# Altium project Glucometer-E.C.- Full V1.PrjPcb
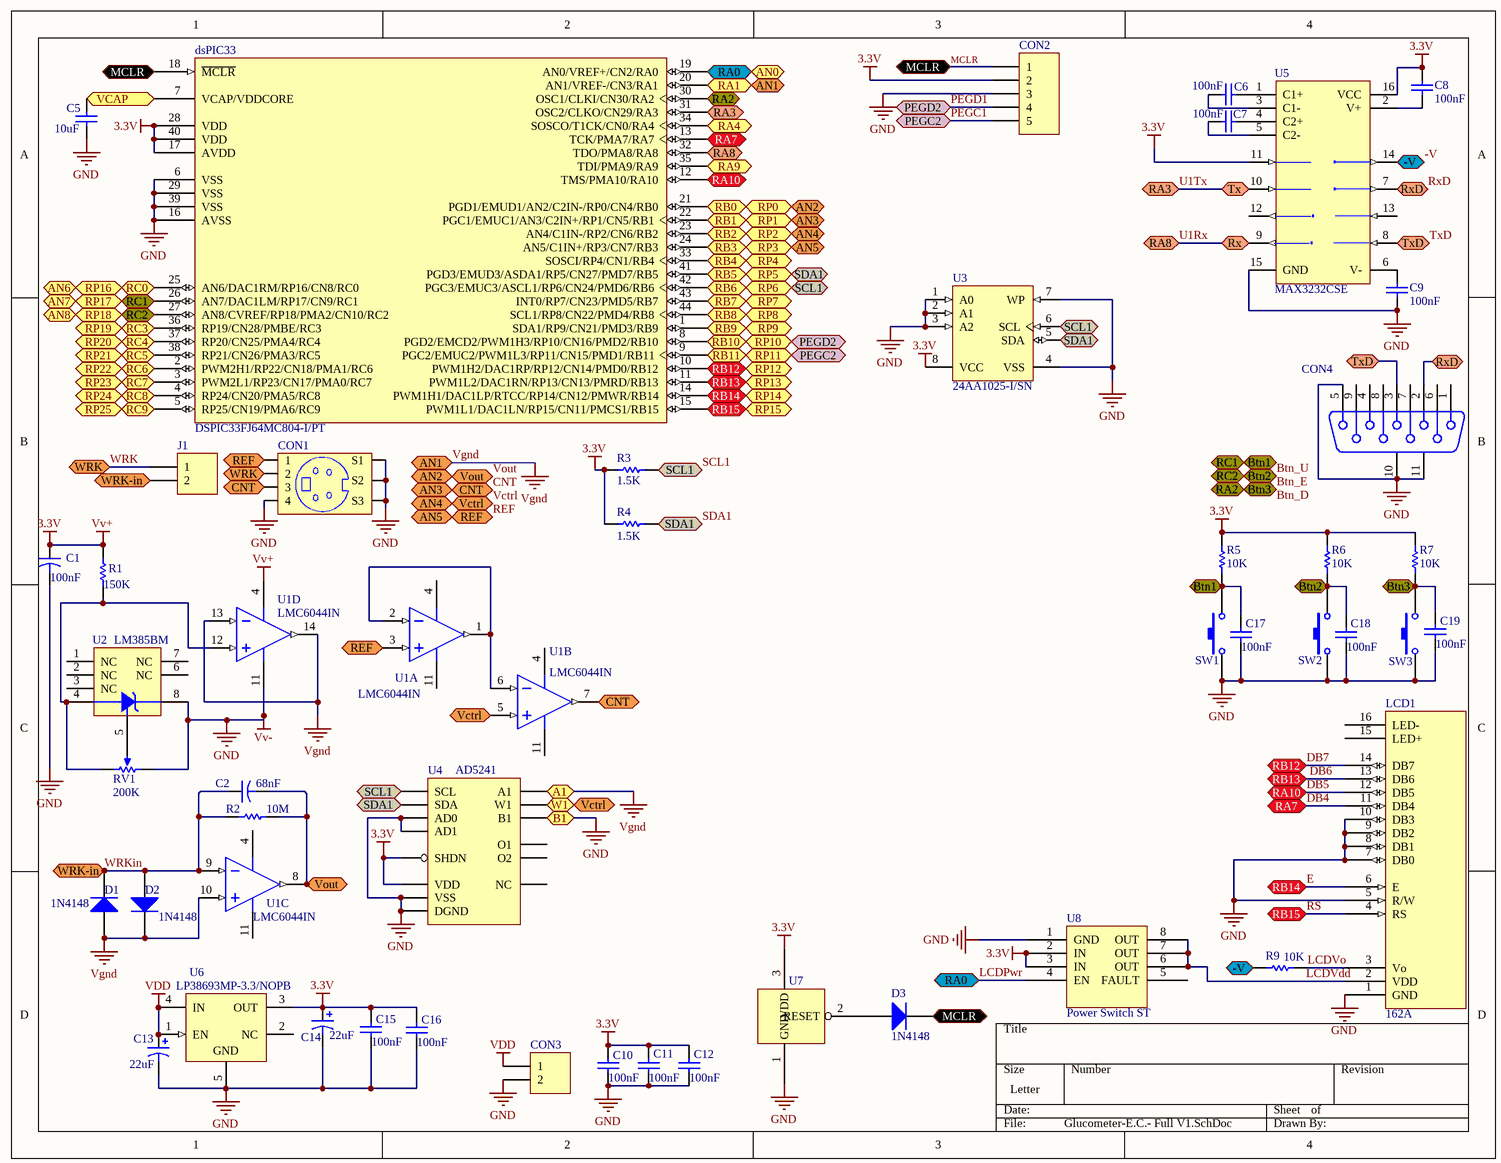
[diagram p0: Glucometer-E.C.- Full V1.SchDoc]
1 sheet, 47 parts. Net scope: flat (ports and power ports of the same name join across sheets).
Board file: Glucometer-E.C.- Full V1.PcbDoc

## Sheet Glucometer-E.C.- Full V1.SchDoc
size Letter

### Parts
C1  value 100nF  [CAPC1608N]  (hidden comment: Cap2)
C2  value 68nF  [CAPC1608N]  (hidden comment: Cap2)
C5  value 10uF  [CAPC2012N]  (hidden comment: Cap)
C6  value 100nF  [RESC1608N]  (hidden comment: Cap)
C7  value 100nF  [RESC1608N]  (hidden comment: Cap)
C8  value 100nF  [RESC1608N]  (hidden comment: Cap)
C9  value 100nF  [RESC1608N]  (hidden comment: Cap)
C10  value 100nF  [CAPC1608N]  (hidden comment: Cap)
C11  value 100nF  [CAPC1608N]  (hidden comment: Cap)
C12  value 100nF  [CAPC1608N]  (hidden comment: Cap)
C13  value 22uF  [C-4x4]  (hidden comment: Cap Pol2)
C14  value 22uF  [C-4x4]  (hidden comment: Cap Pol2)
C15  value 100nF  [CAPC1608N]  (hidden comment: Cap)
C16  value 100nF  [CAPC1608N]  (hidden comment: Cap)
C17  value 100nF  [CAPC1608N]  (hidden comment: Cap)
C18  value 100nF  [CAPC1608N]  (hidden comment: Cap)
C19  value 100nF  [CAPC1608N]  (hidden comment: Cap)
CON1  (no value)  [CDIN2.6-3H4A]
CON2  Header 5  [HDR1X5]  (value not drawn)
CON3  Header 2  [HDR1X2]  (value not drawn)
CON4  D Connector 9  [DSUB1.385-2H9]  (value not drawn)
D1  1N4148  [DO-35]
D2  1N4148  [DO-35]
D3  1N4148  [DO-35]
dsPIC33  DSPIC33FJ64MC804-I/PT  [TQFP-PT44_N]
J1  Header 2  [HDR1X2]  (value not drawn)
LCD1  162A  [HDR1X16]
R1  value 150K  [RESC3216N]  (hidden comment: Res1)
R2  value 10M  [RESC3216N]  (hidden comment: Res1)
R3  value 1.5K  [RESC3216N]  (hidden comment: Res1)
R4  value 1.5K  [RESC3216N]  (hidden comment: Res1)
R5  value 10K  [RESC3216N]  (hidden comment: Res1)
R6  value 10K  [RESC3216N]  (hidden comment: Res1)
R7  value 10K  [RESC3216N]  (hidden comment: Res1)
R9  value 10K  [RESC3216N]  (hidden comment: Res1)
RV1  value 200K  [VR5]  (hidden comment: RPot)
SW1  SW-PB  [DPST-4]  (value not drawn)
SW2  SW-PB  [DPST-4]  (value not drawn)
SW3  SW-PB  [DPST-4]  (value not drawn)
U1  LMC6044IN  [M14A_N]  (parts A,B,C,D of 4)
U2  LM385BM  [M08A_N]
U3  24AA1025-I/SN  [SOIC-SN8_N]
U4  AD5241  [R-14_N]
U5  MAX3232CSE  [NSO16_N]
U6  LP38693MP-3.3/NOPB  [MP05A_N]
U7  Supply Voltage Supervisor  [SOT23]  (value not drawn)
U8  Power Switch ST  [SO8_N]

### Ports
-V, A1, AN0, AN1, AN2, AN3, AN4, AN5, AN6, AN7, AN8, B1, Btn1, Btn2, Btn3, CNT, MCLR, PEGC2, PEGD2, RA0, RA1, RA2, RA3, RA4, RA7, RA8, RA9, RA10, RB0, RB1, RB2, RB3, RB4, RB5, RB6, RB7, RB8, RB9, RB10, RB11, RB12, RB13, RB14, RB15, RC0, RC1, RC2, RC3, RC4, RC5, RC6, RC7, RC8, RC9, REF, RP0, RP1, RP2, RP3, RP4, RP5, RP6, RP7, RP8, RP9, RP10, RP11, RP12, RP13, RP14, RP15, RP16, RP17, RP18, RP19, RP20, RP21, RP22, RP23, RP24, RP25, Rx, RxD, SCL1, SDA1, Tx, TxD, VCAP, Vctrl, Vout, W1, WRK, WRK-in

### Nets
3.3V: C1.1 C8.1 C10.2 C11.2 C12.2 C14.1 C15.2 C16.2 CON2.2 dsPIC33.17(AVDD) dsPIC33.28(VDD) dsPIC33.40(VDD) R1.2 R3.1 R4.1 R5.2 R6.2 R7.2 U1.4(V+) U3.8(VCC) U4.4(VDD) U4.5(SHDN) U5.11(T1IN) U5.16(VCC) U6.3(OUT) U7.3(VDD) U8.2(IN) U8.3(IN)  [also labelled Vv+]
GND: C1.2 C5.1 C9.2 C10.1 C11.1 C12.1 C13.2 C14.2 C15.1 C16.1 C17.1 C18.1 C19.1 CON1.4 CON1.MH1(S1) CON1.MH2(S2) CON1.MH3(S3) CON2.3 CON3.2 CON4.5 CON4.10(MH1) CON4.11(MH2) dsPIC33.6(VSS) dsPIC33.16(AVSS) dsPIC33.29(VSS) dsPIC33.39(VSS) LCD1.1(GND) LCD1.5(R/W) LCD1.7(DB0) LCD1.8(DB1) LCD1.9(DB2) LCD1.10(DB3) RV1.1(TOP) SW1.1 SW2.1 SW3.1 U1.11(V-) U2.8(+V) U3.1(A0) U3.2(A1) U3.3(A2) U3.4(VSS) U3.7(WP) U4.3(B1) U4.8(AD0) U4.9(AD1) U4.10(DGND) U4.11(VSS) U5.15(GND) U6.5(GND) U7.1(GND) U8.1(GND) ; port B1  [also labelled Vv-]
VDD: C13.1 CON3.1 U6.1(EN) U6.4(IN)
Vgnd: D1.1(A) D2.2(K) dsPIC33.20(AN1/VREF-/CN3/RA1) U1.10(IN3+) U1.13(IN4-) U1.14(OUT4) U4.1(A1) ; port RA1, port AN1, port A1
 DB6: dsPIC33.11(PWM1L2/DAC1RN/RP13/CN13/PMRD/RB13) LCD1.13(DB6) ; port RP13, port RB13
-V: R9.2 U5.14(T1OUT) ; port -V
Btn_E: C19.2 dsPIC33.30(OSC1/CLKI/CN30/RA2) R7.1 SW3.2 ; port RA2, port Btn3
Btn_U: C18.2 dsPIC33.27(AN8/CVREF/RP18/PMA2/CN10/RC2) R6.1 SW2.2 ; port RP18, port AN8, port RC2, port Btn2
CNT: CON1.3 dsPIC33.22(PGC1/EMUC1/AN3/C2IN+/RP1/CN5/RB1) U1.7(OUT2) ; port RB1, port RP1, port CNT, port AN3
DB4: dsPIC33.13(TCK/PMA7/RA7) LCD1.11(DB4) ; port RA7
DB5: dsPIC33.12(TMS/PMA10/RA10) LCD1.12(DB5) ; port RA10
DB7: dsPIC33.10(PWM1H2/DAC1RP/RP12/CN14/PMD0/RB12) LCD1.14(DB7) ; port RB12, port RP12
E: dsPIC33.14(PWM1H1/DAC1LP/RTCC/RP14/CN12/PMWR/RB14) LCD1.6(E) ; port RP14, port RB14
LCDPwr: dsPIC33.19(AN0/VREF+/CN2/RA0) U8.4(EN) ; port RA0, port AN0
LCDVdd: LCD1.2(VDD) U8.6(OUT) U8.7(OUT) U8.8(OUT)
LCDVo: LCD1.3(Vo) R9.1
MCLR: CON2.1 D3.2(K) dsPIC33.18(~{MCLR}) ; port MCLR
PEGC1: CON2.5 dsPIC33.9(PGC2/EMUC2/PWM1L3/RP11/CN15/PMD1/RB11) ; port RB11, port RP11, port PEGC2
PEGD1: CON2.4 dsPIC33.8(PGD2/EMCD2/PWM1H3/RP10/CN16/PMD2/RB10) ; port RB10, port RP10, port PEGD2
REF: CON1.1 dsPIC33.24(AN5/C1IN+/RP3/CN7/RB3) U1.3(IN1+) ; port RP3, port REF, port AN5, port RB3
RS: dsPIC33.15(PWM1L1/DAC1LN/RP15/CN11/PMCS1/RB15) LCD1.4(RS) ; port RP15, port RB15
RxD: CON4.2 U5.7(T2OUT) ; port RxD
SCL1: dsPIC33.42(PGC3/EMUC3/ASCL1/RP6/CN24/PMD6/RB6) R3.2 U3.6(SCL) U4.6(SCL) ; port RB6, port RP6, port SCL1
SDA1: dsPIC33.41(PGD3/EMUD3/ASDA1/RP5/CN27/PMD7/RB5) R4.2 U3.5(SDA) U4.7(SDA) ; port RB5, port RP5, port SDA1
TxD: CON4.3 U5.8(R2IN) ; port TxD
U1Rx: dsPIC33.32(TDO/PMA8/RA8) U5.9(R2OUT) ; port Rx, port RA8
U1Tx: dsPIC33.31(OSC2/CLKO/CN29/RA3) U5.10(T2IN) ; port Tx, port RA3
Vctrl: dsPIC33.23(AN4/C1IN-/RP2/CN6/RB2) U1.5(IN2+) U4.2(W1) ; port RB2, port RP2, port Vctrl, port AN4, port W1
Vout: C2.2 dsPIC33.21(PGD1/EMUD1/AN2/C2IN-/RP0/CN4/RB0) R2.1 U1.8(OUT3) ; port RB0, port RP0, port Vout, port AN2
WRK: CON1.2 J1.1 ; port WRK
WRKin: C2.1 D1.2(K) D2.1(A) J1.2 R2.2 U1.9(IN3-) ; port WRK-in
NetC5_2: C5.2 dsPIC33.7(VCAP/VDDCORE) ; port VCAP
NetC6_1: C6.1 U5.1(C1+)
NetC6_2: C6.2 U5.3(C1-)
NetC7_1: C7.1 U5.4(C2+)
NetC7_2: C7.2 U5.5(C2-)
NetC8_2: C8.2 U5.2(V+)
NetC9_1: C9.1 U5.6(V-)
NetC17_2: C17.2 dsPIC33.26(AN7/DAC1LM/RP17/CN9/RC1) R5.1 SW1.2 ; port RP17, port AN7, port RC1, port Btn1
NetD3_1: D3.1(A) U7.2(RESET)
NetdsPIC33_1: dsPIC33.1(SDA1/RP9/CN21/PMD3/RB9) ; port RB9, port RP9
NetdsPIC33_2: dsPIC33.2(PWM2H1/RP22/CN18/PMA1/RC6) ; port RC6, port RP22
NetdsPIC33_3: dsPIC33.3(PWM2L1/RP23/CN17/PMA0/RC7) ; port RC7, port RP23
NetdsPIC33_4: dsPIC33.4(RP24/CN20/PMA5/RC8) ; port RC8, port RP24
NetdsPIC33_5: dsPIC33.5(RP25/CN19/PMA6/RC9) ; port RC9, port RP25
NetdsPIC33_25: dsPIC33.25(AN6/DAC1RM/RP16/CN8/RC0) ; port RP16, port AN6, port RC0
NetdsPIC33_33: dsPIC33.33(SOSCI/RP4/CN1/RB4) ; port RP4, port RB4
NetdsPIC33_34: dsPIC33.34(SOSCO/T1CK/CN0/RA4) ; port RA4
NetdsPIC33_35: dsPIC33.35(TDI/PMA9/RA9) ; port RA9
NetdsPIC33_36: dsPIC33.36(RP19/CN28/PMBE/RC3) ; port RP19, port RC3
NetdsPIC33_37: dsPIC33.37(RP20/CN25/PMA4/RC4) ; port RP20, port RC4
NetdsPIC33_38: dsPIC33.38(RP21/CN26/PMA3/RC5) ; port RP21, port RC5
NetdsPIC33_43: dsPIC33.43(INT0/RP7/CN23/PMD5/RB7) ; port RB7, port RP7
NetdsPIC33_44: dsPIC33.44(SCL1/RP8/CN22/PMD4/RB8) ; port RB8, port RP8
NetR1_1: R1.1 RV1.2(BOT) U1.12(IN4+) U2.4(-V)
NetRV1_3: RV1.3(TAP) U2.5(FB)
NetU1_1: U1.1(OUT1) U1.2(IN1-) U1.6(IN2-)

Not connected (* = marked no-connect by the designer): CON4 1 4 6 7 8 9; LCD1 15(LED+) 16(LED-); U2 1(NC) 2(NC) 3(NC) 6(NC) 7(NC); U4 12(O2) 13(NC) 14(O1); U5 12(R1OUT) 13(R1IN); U6 2(NC); U8 5(FAULT)

### Notes on the sheet
- Labels drawn without touching a wire or pin: Btn_D

### Library data of the parts
C1 C2 = Cap2: Capacitor; Published: 23-Sep-2002; PackageReference: CAPR5-4X5; Publisher: Altium Limited; PackageDescription: Capacitor; 2 Leads
C5-C12 C15-C19 = Cap: Capacitor; Published: 8-Jun-2000; LatestRevisionDate: 17-Jul-2002; LatestRevisionNote: Re-released for DXP Platform.; PackageReference: RAD-0.3; Publisher: Altium Limited; PackageDescription: Radial Cap, Thru-Hole; 2 Leads; 0.3 in Pin Spacing
C13 C14 = Cap Pol2: Polarized Capacitor (Axial); Published: 8-Jun-2000; LatestRevisionDate: 17-Jul-2002; LatestRevisionNote: Re-released for DXP Platform.; PackageReference: POLAR0.8; Publisher: Altium Limited; PackageDescription: Polarized Capacitor; 2 Leads
CON1 = MiniDin 4Pins - SuperVideo: MiniDin 4 Pins
CON2 = Header 5: Header, 5-Pin; LatestRevisionDate: 17-Jul-2002; LatestRevisionNote: Re-released for DXP Platform.; Publisher: Altium Limited
CON3 J1 = Header 2: Header, 2-Pin; LatestRevisionDate: 17-Jul-2002; LatestRevisionNote: Re-released for DXP Platform.; Publisher: Altium Limited
CON4 = D Connector 9: Receptacle Assembly, 9 Position, Right Angle; PackageDocument: O; Positions: 9; Published: 15-Jun-2001; LatestRevisionDate: 17-Jul-2002; LatestRevisionNote: Re-released for DXP Platform.; DatasheetDocument: 1-Sep-1999; PackageReference: 788750; Publisher: Altium Limited; Orientation: Right Angle; Gender: Receptacle
D1-D3 = 1N4148: High Conductance Fast Diode; Published: 8-Jun-2000; LatestRevisionDate: 17-Jul-2002; LatestRevisionNote: Re-released for DXP Platform.; DatasheetDocument: 1997; PackageReference: DO-35; Publisher: Altium Limited; Code_JEDEC: DO-204-AH; ComponentLink1Description: Manufacturer Link; ComponentLink1URL: http://www.fairchildsemi.com/; ComponentLink2Description: Datasheet; ComponentLink2URL: http://www.fairchildsemi.com/ds/1N%2F1N4148.pdf
dsPIC33 = DSPIC33FJ64MC804-I/PT: High-Performance 16-bit Digital Signal Controller, 64 KB Flash, 16 KB RAM, 44-Pin TQFP, Industrial Temperature; Published: 2-Dec-2009; DatasheetVersion: revD, Nov-2009; PackageVersion: revBB, Aug-2009; PackageReference: TQFP-PT44; Publisher: Altium Limited; PackageDescription: 44-Lead Plastic Thin Quad Flatpack (PT) - 10x10x1mm Body, 2.00mm [TQFP]; Supplier 1: Digi-Key; Supplier Part Number 1: DSPIC33FJ64MC804-I/PT-ND; Supplier 2: Farnell; Supplier Part Number 2: 1576844; Code_JEDEC: MS-026; ComponentLink1Description: Datasheet; ComponentLink1URL: http://ww1.microchip.com/downloads/en/DeviceDoc/70291D.pdf; ComponentLink2Description: Packaging Specification; ComponentLink2URL: http://www.microchip.com/stellent/groups/techpub_sg/documents/packagingspec/en012702.pdf; ComponentLink3Description: Microchip.com Home; ComponentLink3URL: http://www.microchip.com/
LCD1 = 162A: 16 char * 2 line LCD character display with b/light
R1-R7 R9 = Res1: Resistor; Published: 8-Jun-2000; LatestRevisionDate: 17-Jul-2002; LatestRevisionNote: Re-released for DXP Platform.; PackageReference: AXIAL-0.3; Publisher: Altium Limited; PackageDescription: Axial Device, Thru-Hole; 2 Leads; 0.3 in Pin Spacing
RV1 = RPot: Potentiometer; pin to pad: 2>3 3>2; Sim Note: Enter the Resistance value and the set point into parameter fields.; Set Position: 0.5; Published: 8-Jun-2000; LatestRevisionDate: 17-Jul-2002; LatestRevisionNote: Re-released for DXP Platform.; PackageReference: VR5; Publisher: Altium Limited; PackageDescription: Variable Resistor, Thru-Hole; 3 Leads
SW1-SW3 = SW-PB: Switch; Published: 24-Mar-1999; LatestRevisionDate: 17-Jul-2002; LatestRevisionNote: Re-released for DXP Platform.; PackageReference: SPST-2; Publisher: Altium Limited; PackageDescription: Switch; 2 Leads
U1 = LMC6044IN: CMOS Quad Micropower Operational Amplifier, 14-pin MDIP; Manufacturer: National Semiconductor; PackageTopMarking: NSUZXYYTTE#*LMC6044IN; PowerWise: Y; CompType: Amplifiers; Published: 4-Dec-2008; LatestRevisionDate: 13-Jan-2009; LatestRevisionNote: Sim Model Added.; DatasheetVersion: Aug-2000; PackageVersion: revG, May-2006; PackageReference: N14A; Publisher: Altium Limited; PackageDescription: MDIP, .750 x .250 x.130in, 14 Lead, .100in Pitch; Supplier 1: Farnell; Supplier Part Number 1: 9494634; PartNumber: LMC6044IN; RoHS: N; PinCount: 14; Code_JEDEC: MS-001-AA; ComponentLink1Description: LMC6044 Datasheet; ComponentLink1URL: http://www.national.com/ds/LM/LMC6044.pdf; ComponentLink2Description: LMC6044 Web Page; ComponentLink2URL: http://www.national.com/pf/LM/LMC6044.html; ComponentLink3Description: N14A Package Page; ComponentLink3URL: http://www.national.com/packaging/folders/n14a.html
U2 = LM385BM: Adjustable Micropower Voltage Reference, 8-pin Narrow SOIC; Manufacturer: National Semiconductor; PackageTopMarking: NSZXTT*LM385*BM; PowerWise: N; CompType: Voltage Reference IC; Published: 4-Dec-2008; DatasheetVersion: Jan-2008; PackageVersion: revM, May-2009; PackageReference: M08A; Publisher: Altium Limited; PackageDescription: SOIC Narrow, 4.9 x 3.9 x 1.45mm, 8 Lead, 1.27mm Pitch; Supplier 1: Farnell; Supplier Part Number 1: 953817; PartNumber: LM385BM; RoHS: N; PinCount: 8; Code_JEDEC: MS-012-AA; Code_IPC: SOIC127P600-8; ComponentLink1Description: LM385-ADJ Datasheet; ComponentLink1URL: http://www.national.com/ds/LM/LM385-ADJ.pdf; ComponentLink2Description: LM385-ADJ Web Page; ComponentLink2URL: http://www.national.com/pf/LM/LM385-ADJ.html; ComponentLink3Description: M08A Package Page; ComponentLink3URL: http://www.national.com/packaging/folders/m08a.html
U3 = 24AA1025-I/SN: 1 Mbit, 400kHz, 1.7V, 8-Pin SOIC 150mil, Industrial Temperature; Published: 2-Dec-2009; DatasheetVersion: revF, Oct-2008; PackageVersion: revBB, Aug-2009; PackageReference: SOIC-SN8; Publisher: Altium Limited; PackageDescription: 8-Lead Plastic Small Outline (SN) - Narrow, 3.90mm Body [SOIC]; Supplier 1: Digi-Key; Supplier Part Number 1: 24AA1025-I/SN-ND; Code_JEDEC: MS-012; Code_IPC: SOIC127P600-8; ComponentLink1Description: Datasheet; ComponentLink1URL: http://ww1.microchip.com/downloads/en/DeviceDoc/21941F.pdf; ComponentLink2Description: Packaging Specification; ComponentLink2URL: http://www.microchip.com/stellent/groups/techpub_sg/documents/packagingspec/en012702.pdf; ComponentLink3Description: Microchip.com Home; ComponentLink3URL: http://www.microchip.com/
U4 = AD5241: AD5241BR
U5 = MAX3232CSE: 3.0V TO 5.5V, Low-Power, up to 1Mbps, True RS-232 Transceiver Using Four 0.1µF External Capacitor; Published: 16-Jan-2001; LatestRevisionDate: 13-Apr-2006; LatestRevisionNote: IPC-7351 Footprint Added.; DatasheetVersion: Mar-1999; PackageReference: NSO16; Publisher: Altium Limited; PackageDescription: 16-Pin Small Outline Integrated Circuit 1.27 mm Pitch; Code_JEDEC: MS-012-AC; Code_IPC: SOIC127P600-16; ComponentLink1Description: Manufacturer Link; ComponentLink1URL: http://www.maxim-ic.com/; ComponentLink2Description: Datasheet; ComponentLink2URL: http://pdfserv.maxim-ic.com/en/ds/MAX3222-MAX3241.pdf
U6 = LP38693MP-3.3/NOPB: 500mA Low Dropout CMOS Linear Regulators Stable with Ceramic Output Capacitors, 5-pin SOT-223, Pb-Free; Manufacturer: National Semiconductor; PackageTopMarking: XYTT*LJYB; PowerWise: Y; CompType: LDO IC; Published: 1-Mar-2010; DatasheetVersion: Sep-2005; PackageVersion: revA, Jan-2000; PackageReference: MP05A; Publisher: Altium Limited; PackageDescription: Moldec SOT-223, 6.50 x 3.56 x 1.6mm Body, 5 Lead, 1.5mm Pitch; Supplier 1: Digi-Key; Supplier Part Number 1: LP38693MP-3.3TR-ND; Supplier 2: Digi-Key; Supplier Part Number 2: LP38693MP-3.3CT-ND; Supplier 3: Digi-Key; Supplier Part Number 3: LP38693MP-3.3DKR-ND; Supplier 4: Farnell; Supplier Part Number 4: 1559648; PartNumber: LP38693MP-3.3/NOPB; RoHS: Y; PinCount: 5; Code_JEDEC: TO-261-AB; Code_IPC: SOT223-5; ComponentLink1Description: LP38693 Datasheet; ComponentLink1URL: http://www.national.com/ds/LP/LP38693.pdf; ComponentLink2Description: LP38693 Web Page; ComponentLink2URL: http://www.national.com/pf/LP/LP38693.html; ComponentLink3Description: MP05A Package Page; ComponentLink3URL: http://www.national.com/packaging/folders/mp05a.html
U8 = Power Switch ST: STMPS2161